# EAGLE design AlarisHandV1 (EAGLE 9.6.2)
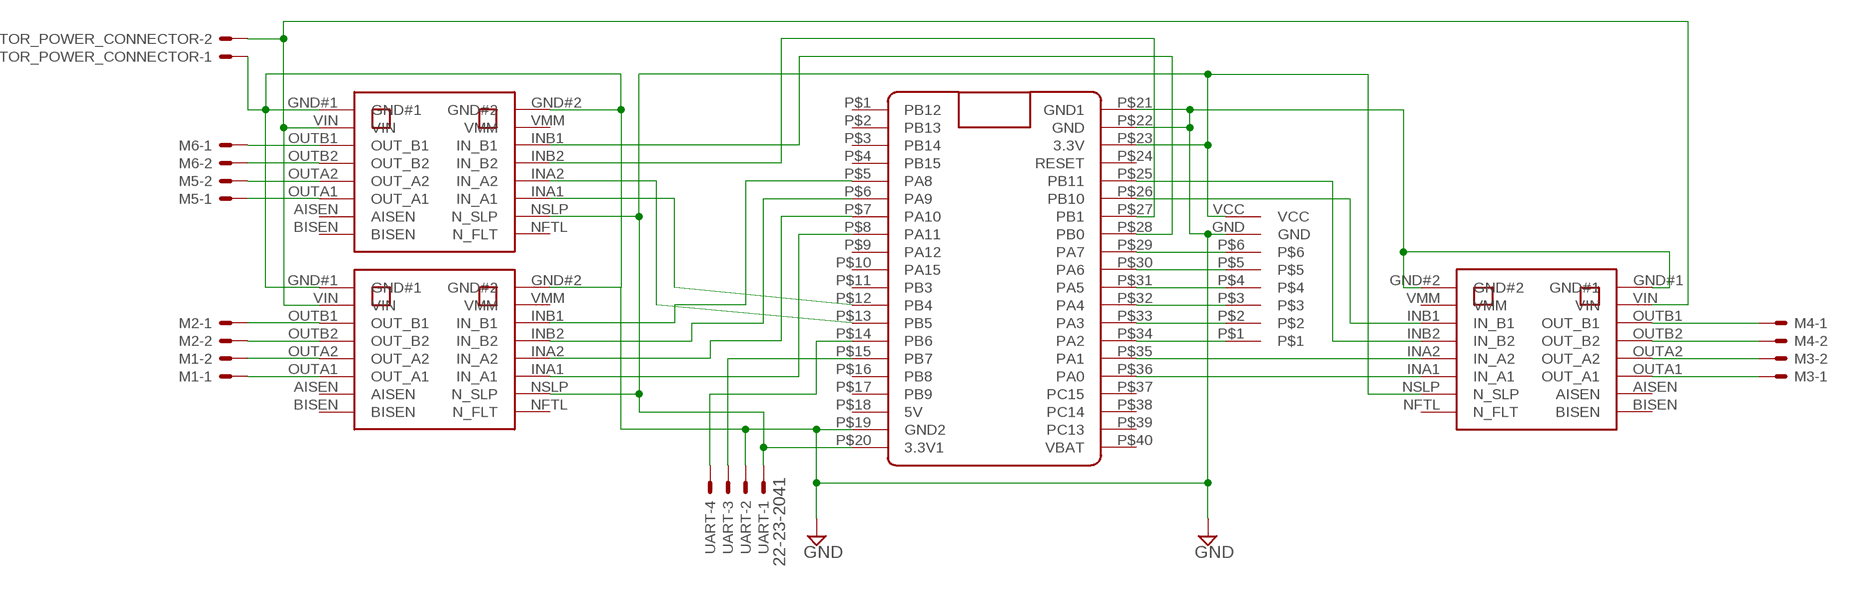
[diagram p0: schematic, sheet 1]

## Parts
M1  22-23-2021  [22-23-2021]
M2  22-23-2021  [22-23-2021]
M3  22-23-2021  [22-23-2021]
M4  22-23-2021  [22-23-2021]
M5  22-23-2021  [22-23-2021]
M6  22-23-2021  [22-23-2021]
MOTOR_POWER_CONNECTOR  22-23-2021  [22-23-2021]
U$1  POLOLUDRV8833  [POLOLUDRV8833]
U$2  POLOLUDRV8833  [POLOLUDRV8833]
U$3  POLOLUDRV8833  [POLOLUDRV8833]
U$4  BLUE_PILL  [BLUE_PILL]
U$5  SENSOR_RAIL  [SENSOR_RAIL]
UART  22-23-2041  [22-23-2041]

## Nets
3.3V [power]: U$1.NSLP(N_SLP) U$2.NSLP(N_SLP) U$3.NSLP(N_SLP) U$4.P$20(3.3V1) U$4.P$23(3.3V) U$5.VCC UART.1
GND [power]: MOTOR_POWER_CONNECTOR.1 U$1.GND#1 U$1.GND#2 U$2.GND#1 U$2.GND#2 U$3.GND#1 U$3.GND#2 U$4.P$19(GND2) U$4.P$21(GND1) U$4.P$22(GND) U$5.GND UART.2
M1A [motor]: M1.1 U$1.OUTA1(OUT_A1)
M1B [motor]: M1.2 U$1.OUTA2(OUT_A2)
M2A [motor]: M2.1 U$1.OUTB1(OUT_B1)
M2B [motor]: M2.2 U$1.OUTB2(OUT_B2)
M3A [motor]: M3.1 U$3.OUTA1(OUT_A1)
M3B [motor]: M3.2 U$3.OUTA2(OUT_A2)
M4A [motor]: M4.1 U$3.OUTB1(OUT_B1)
M4B [motor]: M4.2 U$3.OUTB2(OUT_B2)
M5A [motor]: M5.1 U$2.OUTA1(OUT_A1)
M5B [motor]: M5.2 U$2.OUTA2(OUT_A2)
M6A [motor]: M6.1 U$2.OUTB1(OUT_B1)
M6B [motor]: M6.2 U$2.OUTB2(OUT_B2)
MOTOR_POWER [power]: MOTOR_POWER_CONNECTOR.2 U$1.VIN U$2.VIN U$3.VIN
N$1: U$4.P$14(PB6) UART.4
N$2: U$1.INA1(IN_A1) U$4.P$8(PA11)
N$3: U$1.INA2(IN_A2) U$4.P$7(PA10)
N$4: U$1.INB2(IN_B2) U$4.P$6(PA9)
N$5: U$3.INB2(IN_B2) U$4.P$25(PB11)
N$6: U$3.INB1(IN_B1) U$4.P$26(PB10)
N$7: U$3.INA2(IN_A2) U$4.P$35(PA1)
N$8: U$3.INA1(IN_A1) U$4.P$36(PA0)
N$9: U$1.INB1(IN_B1) U$4.P$5(PA8)
N$16: U$4.P$34(PA2) U$5.P$1
N$17: U$4.P$29(PA7) U$5.P$6
N$18: U$4.P$30(PA6) U$5.P$5
N$19: U$4.P$31(PA5) U$5.P$4
N$20: U$4.P$32(PA4) U$5.P$3
N$21: U$4.P$33(PA3) U$5.P$2
N$25: U$2.INA1(IN_A1) U$4.P$12(PB4)
N$26: U$2.INA2(IN_A2) U$4.P$13(PB5)
N$31: U$2.INB1(IN_B1) U$4.P$28(PB0)
N$32: U$2.INB2(IN_B2) U$4.P$27(PB1)
UART_RX: U$4.P$15(PB7) UART.3
Unconnected: U$1.AISEN U$1.BISEN U$1.NFTL(N_FLT) U$1.VMM U$2.AISEN U$2.BISEN U$2.NFTL(N_FLT) U$2.VMM U$3.AISEN U$3.BISEN U$3.NFTL(N_FLT) U$3.VMM U$4.P$1(PB12) U$4.P$2(PB13) U$4.P$3(PB14) U$4.P$4(PB15) U$4.P$9(PA12) U$4.P$10(PA15) U$4.P$11(PB3) U$4.P$16(PB8) U$4.P$17(PB9) U$4.P$18(5V) U$4.P$24(RESET) U$4.P$37(PC15) U$4.P$38(PC14) U$4.P$39(PC13) U$4.P$40(VBAT)

## Library data of the parts
M1-M6 = AlarisHandLib:22-23-2021: .100" (2.54mm) Center Header - 2 Pin; MF: MOLEX; MPN: 22-23-2021; OC_FARNELL: 1462926; OC_NEWARK: 25C3832
MOTOR_POWER_CONNECTOR = con-molex:22-23-2021: .100" (2.54mm) Center Header - 2 Pin; MF: MOLEX; MPN: 22-23-2021; OC_FARNELL: 1462926; OC_NEWARK: 25C3832
U$1-U$3 = AlarisHandLib:POLOLUDRV8833
U$4 = BluePill:BLUE_PILL
U$5 = AlarisHandLib:SENSOR_RAIL
UART = con-molex:22-23-2041: .100" (2.54mm) Center Header - 4 Pin; MF: MOLEX; MPN: 22-23-2041; OC_FARNELL: 1462920; OC_NEWARK: 38C0355

## Net classes
0 default: width 0.381 mm
1 motor: width 1.016 mm
2 power: width 1.016 mm

## Board
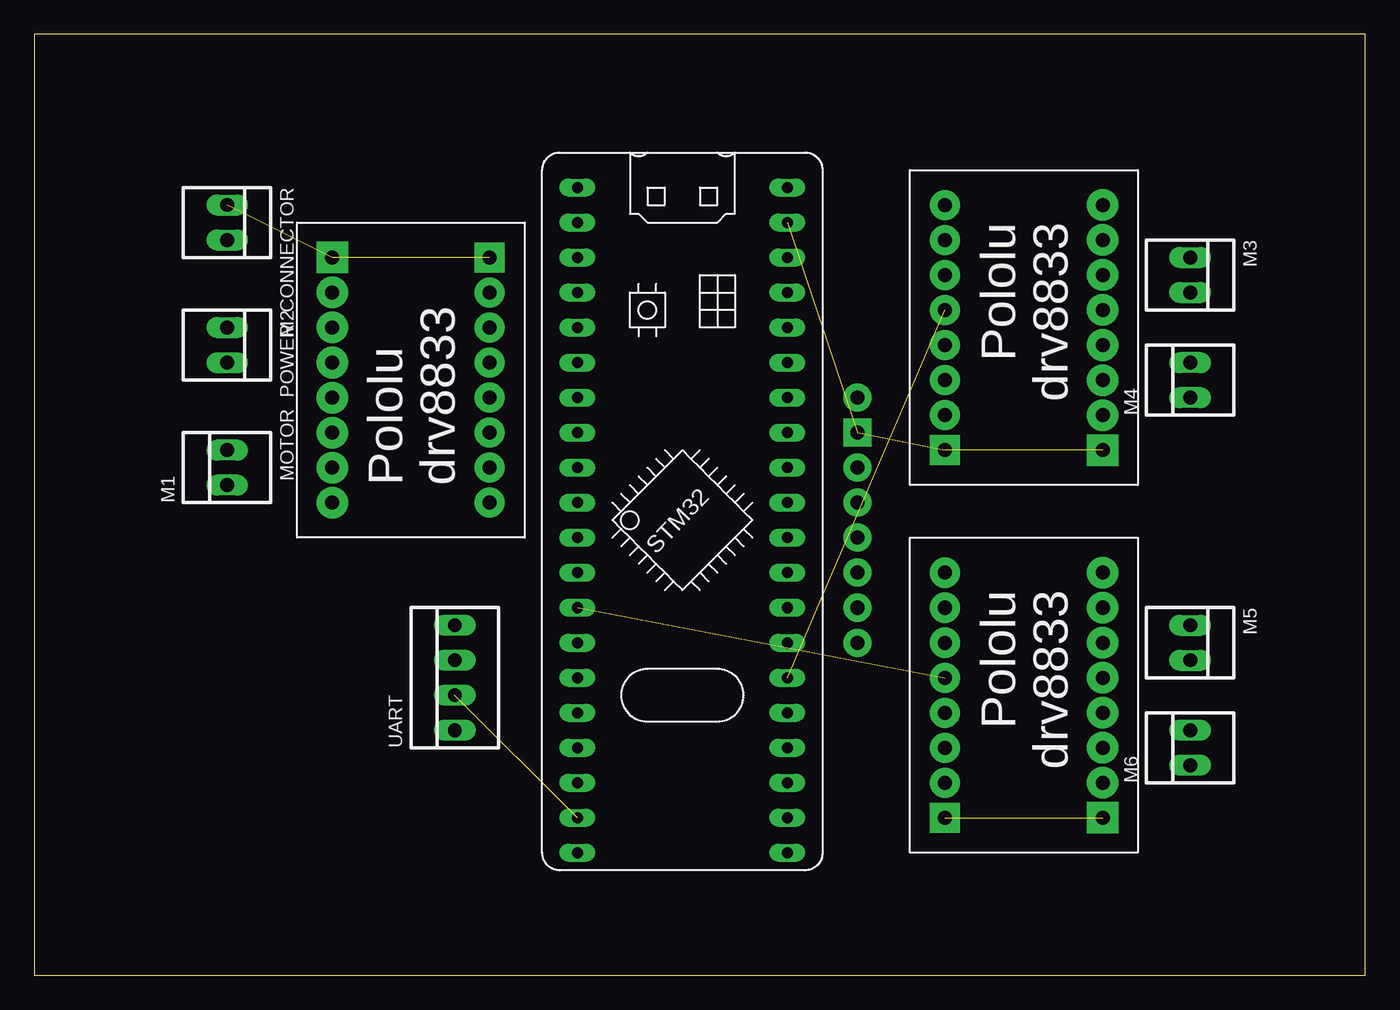
[diagram p1: board, top side]
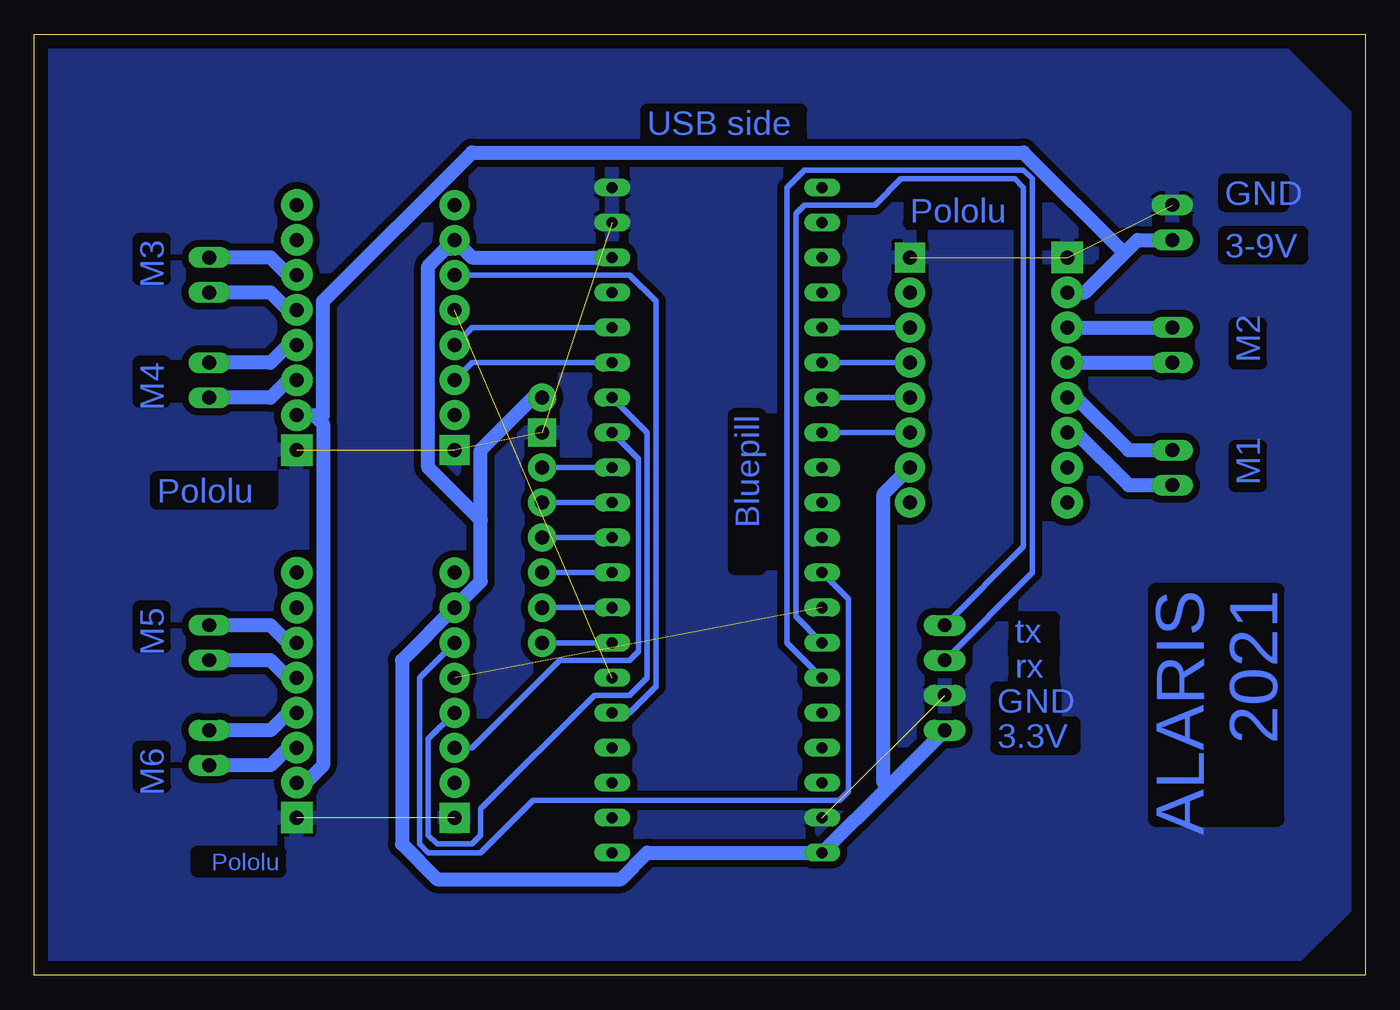
[diagram p2: board, bottom side, seen from below]

Size 96.5 x 68.25 mm. Coordinates in mm from the lower left corner, seen from the top.
Outline: 0,0 96.5,0 96.5,68.25 0,68.25 0,0
Copper layers (1*16): Top 0.035mm / dielectric 1.5mm / Bottom 0.035mm
Design rules "default": minimum track width 6mil, minimum drill 0.35mm, track to track 6mil, track to pad 6mil, pad to pad 6mil, via to via 6mil, smd to smd 6mil, copper to edge 40mil, drill to drill 6mil, minimum pad ring 10mil, minimum via ring 8mil, stop-mask expansion 4mil, vias tented up to drill 0mil, thermal gap 10mil

### Footprints (pad centres in the part's own frame; a part is rotated, then mirrored left to right if it is on the bottom)
22-23-2021 = drill 1 long: 1 -1.27,0; 2 1.27,0
POLOLUDRV8833 = drill 1.016 pad 2.286: AISEN -8.89,-2.54; BISEN -8.89,-5.08; OUTA1 -8.89,0; OUTA2 -8.89,2.54; OUTB1 -8.89,7.62; OUTB2 -8.89,5.08; VIN -8.89,10.16 | drill 1.016 pad 2.286 square: GND#1 -8.89,12.7 | drill 1.016 pad 2.184 square: GND#2 2.54,12.7 | drill 1.016 pad 2.184: INA1 2.54,0; INA2 2.54,2.54; INB1 2.54,7.62; INB2 2.54,5.08; NFTL 2.54,-5.08; NSLP 2.54,-2.54; VMM 2.54,10.16
BLUE_PILL = drill 0.8 long: P$1 -7.62,15.24; P$2 -7.62,12.7; P$3 -7.62,10.16; P$4 -7.62,7.62; P$5 -7.62,5.08; P$6 -7.62,2.54; P$7 -7.62,0; P$8 -7.62,-2.54; P$9 -7.62,-5.08; P$10 -7.62,-7.62; P$11 -7.62,-10.16; P$12 -7.62,-12.7; P$13 -7.62,-15.24; P$14 -7.62,-17.78; P$15 -7.62,-20.32; P$16 -7.62,-22.86; P$17 -7.62,-25.4; P$18 -7.62,-27.94; P$19 -7.62,-30.48; P$20 -7.62,-33.02; P$21 7.62,15.24; P$22 7.62,12.7; P$23 7.62,10.16; P$24 7.62,7.62; P$25 7.62,5.08; P$26 7.62,2.54; P$27 7.62,0; P$28 7.62,-2.54; P$29 7.62,-5.08; P$30 7.62,-7.62; P$31 7.62,-10.16; P$32 7.62,-12.7; P$33 7.62,-15.24; P$34 7.62,-17.78; P$35 7.62,-20.32; P$36 7.62,-22.86; P$37 7.62,-25.4; P$38 7.62,-27.94; P$39 7.62,-30.48; P$40 7.62,-33.02
SENSOR_RAIL = drill 1.016 pad 2.032 square: GND 0,-15.24 | drill 1.016 pad 2.032: P$1 0,0; P$2 0,-2.54; P$3 0,-5.08; P$4 0,-7.62; P$5 0,-10.16; P$6 0,-12.7; VCC 0,-17.78
22-23-2041 = drill 1 long: 1 -3.81,0; 2 -1.27,0; 3 1.27,0; 4 3.81,0

### Placement (x,y rotation side)
M1  13.97,36.83 90 top
M2  13.97,45.72 270 top
M3  83.82,50.8 270 top
M4  83.82,43.18 90 top
M5  83.82,24.13 270 top
M6  83.82,16.51 90 top
MOTOR_POWER_CONNECTOR  13.97,54.61 270 top
U$1  30.48,39.37 0 top
U$2  68.58,24.13 180 top
U$3  68.58,50.8 180 top
U$4  46.99,41.91 0 top
U$5  59.69,24.13 180 top
UART  30.48,21.59 90 top

### Tracks (layer width: path | path; a pad name or v marks a point on that pad's centre or on a via)
3.3V
  Bottom 1.016: UART.1 34.61,13.65 | 34.61,13.65 U$4.P$20 52.07,8.89 53.98,6.99 67.31,6.99 69.85,9.53 69.85,22.86 U$2.NSLP 64.14,28.57 64.14,33.02 | U$1.NSLP 34.92,34.92 34.92,13.97 34.61,13.65 | U$4.P$23 64.77,52.07 U$3.NSLP 66.04,52.7 66.68,52.7 67.95,51.44 67.95,36.83 64.14,33.02 | U$5.VCC 60.32,41.91 64.14,38.1 64.14,33.02
GND  (7 unrouted)
  pour Bottom (isolate 0.508): 0,6.35 0,60.96 7.62,68.58 95.25,68.58 95.25,0 6.35,0
M1A
  Bottom 1.016: M1.1 17.14,35.56 20.95,39.37 U$1.OUTA1
M1B
  Bottom 1.016: M1.2 17.14,38.1 20.95,41.91 U$1.OUTA2
M2A
  Bottom 1.016: U$1.OUTB1 M2.1
M2B
  Bottom 1.016: U$1.OUTB2 M2.2
M3A
  Bottom 1.016: M3.1 79.38,52.07 78.11,50.8 U$3.OUTA1
M3B
  Bottom 1.016: M3.2 79.38,49.53 78.11,48.26 U$3.OUTA2
M4A
  Bottom 1.016: M4.1 79.38,41.91 78.11,43.18 U$3.OUTB1
M4B
  Bottom 1.016: M4.2 79.38,44.45 78.11,45.72 U$3.OUTB2
M5A
  Bottom 1.016: M5.1 79.38,25.4 78.11,24.13 U$2.OUTA1
M5B
  Bottom 1.016: M5.2 79.38,22.86 78.11,21.59 U$2.OUTA2
M6A
  Bottom 1.016: M6.1 79.38,15.24 78.11,16.51 U$2.OUTB1
M6B
  Bottom 1.016: M6.2 79.38,17.78 78.11,19.05 U$2.OUTB2
MOTOR_POWER
  Bottom 1.016: MOTOR_POWER_CONNECTOR.2 16.51,53.34 17.46,52.39 | 17.46,52.39 20.32,49.53 U$1.VIN | U$2.VIN 76.84,13.97 75.57,15.24 75.57,40.01 75.88,40.32 | 75.88,40.32 76.2,40.64 U$3.VIN | 17.46,52.39 24.77,59.69 64.77,59.69 75.57,48.89 75.57,40.64 75.88,40.32
N$1
  Bottom 0.381: U$4.P$14 41.27,26.04 41.27,55.24 40.64,55.88 35.56,55.88 33.66,57.78 25.4,57.78 24.77,57.15 24.77,31.11 UART.4
N$2
  Bottom 0.381: U$1.INA1 U$4.P$8
N$3
  Bottom 0.381: U$1.INA2 U$4.P$7
N$4
  Bottom 0.381: U$1.INB2 U$4.P$6
N$5
  Bottom 0.381: U$4.P$25 64.77,46.99 U$3.INB2
N$6
  Bottom 0.381: U$4.P$26 64.77,44.45 U$3.INB1
N$7  (1 unrouted)
N$8
  Bottom 0.381: U$4.P$36 53.34,19.05 51.44,20.95 51.44,48.89 53.34,50.8 U$3.INA1
N$9
  Bottom 0.381: U$1.INB1 U$4.P$5
N$16
  Bottom 0.381: U$5.P$1 U$4.P$34
N$17
  Bottom 0.381: U$5.P$6 U$4.P$29
N$18
  Bottom 0.381: U$5.P$5 U$4.P$30
N$19
  Bottom 0.381: U$5.P$4 U$4.P$31
N$20
  Bottom 0.381: U$5.P$3 U$4.P$32
N$21
  Bottom 0.381: U$5.P$2 U$4.P$33
N$25
  Bottom 0.381: U$4.P$12 37.46,27.3 37.46,13.34 38.1,12.7 60.32,12.7 64.14,8.89 67.95,8.89 68.58,9.53 68.58,21.59 U$2.INA1
N$26  (1 unrouted)
N$31
  Bottom 0.381: U$4.P$28 52.7,37.46 52.7,23.49 53.34,22.86 58.42,22.86 64.77,16.51 U$2.INB1
N$32
  Bottom 0.381: U$4.P$27 52.07,39.37 52.07,21.59 53.34,20.32 55.88,20.32 64.14,12.07 64.14,10.16 64.77,9.53 67.31,9.53 67.95,10.16 67.95,17.14 U$2.INB2
UART_RX
  Bottom 0.381: U$4.P$15 41.91,24.13 41.91,57.15 40.64,58.42 24.77,58.42 24.13,57.78 24.13,29.21 UART.3

### Text on the board
Bottom: USB side | GND | Pololu | M3 | 3-9V | M2 | M4 | Bluepill | M1 | Pololu | ALARIS / 2021 | M5 | tx | rx | GND | 3.3V | M6 | Pololu